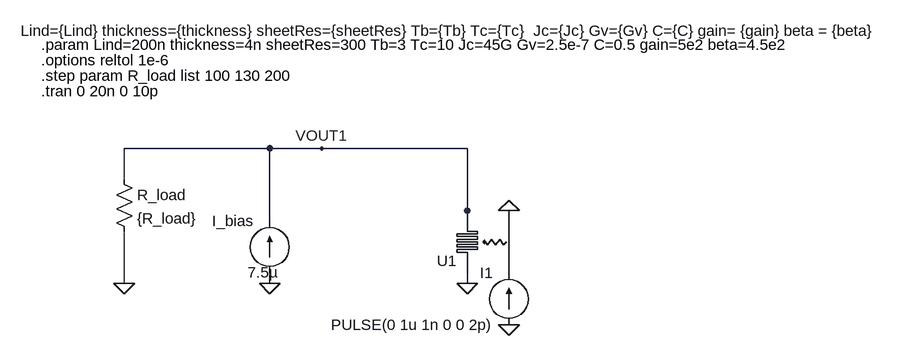
[diagram p0: schematic snspd-thermal.asc]
snspd-thermal.asc, the LTspice schematic file:
Version 4
SHEET 1 1252 680
WIRE -352 -608 -576 -608
WIRE -272 -608 -352 -608
WIRE -48 -608 -272 -608
WIRE -576 -560 -576 -608
WIRE -48 -512 -48 -608
WIRE -352 -496 -352 -608
WIRE -48 -496 -48 -512
WIRE -576 -400 -576 -480
WIRE -352 -400 -352 -416
WIRE -48 -400 -48 -416
FLAG -272 -608 VOUT1
FLAG 16 -336 0
FLAG 16 -512 0
FLAG -576 -400 0
FLAG -48 -400 0
FLAG -352 -400 0
SYMBOL res -592 -576 R0
SYMATTR InstName R_load
SYMATTR Value {R_load}
SYMBOL current -352 -416 R180
WINDOW 0 24 80 Left 2
WINDOW 3 -13 1 Left 2
WINDOW 123 0 0 Left 0
WINDOW 39 0 0 Left 0
SYMATTR InstName I_bias
SYMATTR Value 7.5µ
SYMBOL snspd_photon_port -48 -464 R180
WINDOW 39 21 325 Center 2
SYMATTR SpiceLine Lind={Lind} thickness={thickness} sheetRes={sheetRes} Tb={Tb} Tc={Tc}  Jc={Jc} Gv={Gv} C={C} gain= {gain} beta = {beta}
SYMATTR InstName U1
SYMBOL current 16 -336 R180
WINDOW 0 24 80 Left 2
WINDOW 3 24 0 Left 2
WINDOW 123 0 0 Left 0
WINDOW 39 0 0 Left 0
SYMATTR InstName I1
SYMATTR Value PULSE(0 1u 1n 0 0 2p)
TEXT -704 -696 Left 2 !.tran 0 20n 0 10p
TEXT -704 -744 Left 2 !.options reltol 1e-6
TEXT -704 -720 Left 2 !.step param R_load list 100 130 200
TEXT -704 -768 Left 2 !.param Lind=200n thickness=4n sheetRes=300 Tb=3 Tc=10 Jc=45G Gv=2.5e-7 C=0.5 gain=5e2 beta=4.5e2

The netlist it stands for:
* snspd-thermal.asc
R_load VOUT1 0 {R_load}
I_bias 0 VOUT1 7.5µ
XU1 P001 0 0 VOUT1 nanowireDynTherm Lind={Lind} thickness={thickness} sheetRes={sheetRes} Tb={Tb} Tc={Tc}  Jc={Jc} Gv={Gv} C={C} gain= {gain} beta = {beta}  ; pins gate-in photon-out ? ?
I1 0 P001 PULSE(0 1u 1n 0 0 2p)
.tran 0 20n 0 10p
.options reltol 1e-6
.step param R_load list 100 130 200
.param Lind=200n thickness=4n sheetRes=300 Tb=3 Tc=10 Jc=45G Gv=2.5e-7 C=0.5 gain=5e2 beta=4.5e2
.lib snspd.lib
.backanno
.end